# Altium schematic sheet MediaControllerSchem.SchDoc
size A4
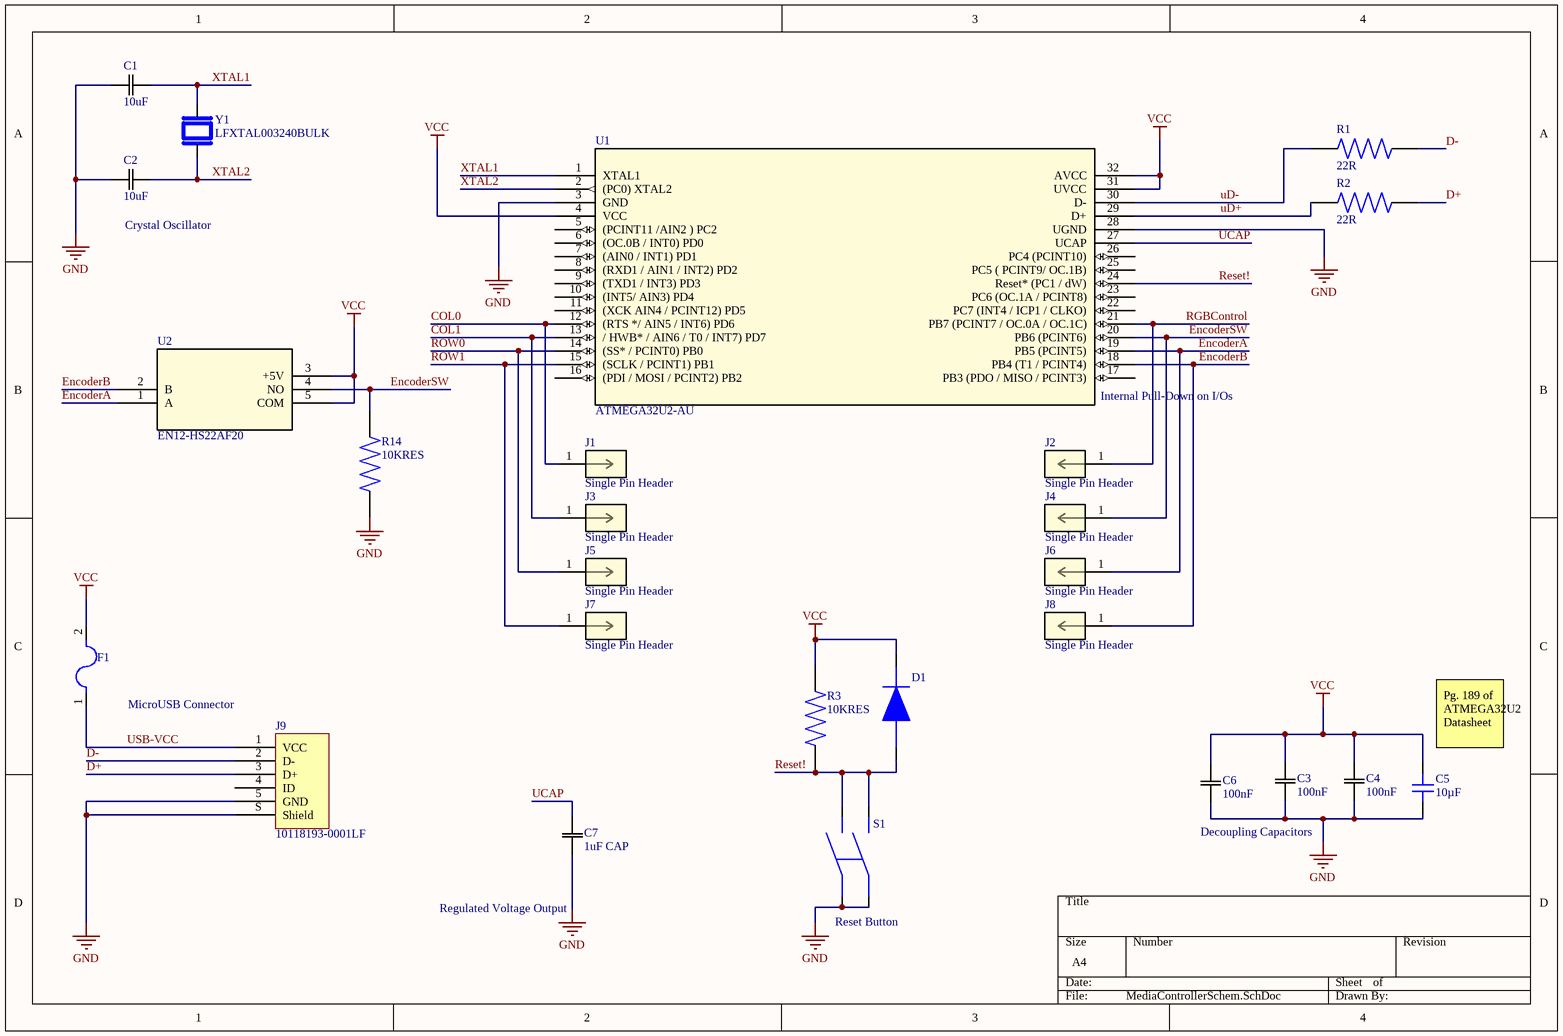
[diagram p0: MediaControllerSchem.SchDoc]

## Parts
C1  10uF  [CAPC17090_87N_KEM-L]
C2  10uF  [CAPC17090_87N_KEM-L]
C3  100nF  [CAPC0603_87N_KEM-M]
C4  100nF  [CAPC0603_87N_KEM-M]
C5  10µF  [CAP 0603_1608]
C6  100nF  [CAPC0603_87N_KEM-M]
C7  1uF CAP  [1UFCAP-M]
D1  RectifierDiode  [DO-219AB_VIS-M]  (value not drawn)
F1  500mAFuse  [FUSC6125X279N]  (value not drawn)
J1  Single Pin Header  [CON1_1X1_TU_TSW]
J2  Single Pin Header  [CON1_1X1_TU_TSW]
J3  Single Pin Header  [CON1_1X1_TU_TSW]
J4  Single Pin Header  [CON1_1X1_TU_TSW]
J5  Single Pin Header  [CON1_1X1_TU_TSW]
J6  Single Pin Header  [CON1_1X1_TU_TSW]
J7  Single Pin Header  [CON1_1X1_TU_TSW]
J8  Single Pin Header  [CON1_1X1_TU_TSW]
J9  10118193-0001LF  [FCI USB 10118193-0001LF]
R1  22R  [RES0603_22OHM]
R2  22R  [RES0603_22OHM]
R3  10KRES  [RES0603]
R14  10KRES  [RES0603]
S1  TacticalSwitch  [TACTILESWITCH]  (value not drawn)
U1  ATMEGA32U2-AU  [32A_ATM]
U2  EN12-HS22AF20  [EN12-HS_TTE]
Y1  LFXTAL003240BULK  [LFXTAL003240BULK]

## Nets
GND: C1.1 C2.1 C3.1 C4.1 C5.1 C6.1 C7.1 J9.5(GND) J9.S(Shield) R14.1 S1.1 S1.2 U1.3(GND) U1.28(UGND)
VCC: C3.2 C4.2 C5.2 C6.2 D1.2 F1.2 R3.2 U1.4(VCC) U1.31(UVCC) U1.32(AVCC) U2.3(+5V) U2.5(COM)
COL0: J1.1 U1.12((RTS_*/_AIN5_/_INT6)_PD6)
COL1: J3.1 U1.13(/_HWB*_/_AIN6_/_T0_/_INT7)_PD7)
D+: J9.3(D+) R2.2
D-: J9.2(D-) R1.2
EncoderA: J6.1 U1.19(PB5_(PCINT5)) U2.1(A)
EncoderB: J8.1 U1.18(PB4_(T1_/_PCINT4)) U2.2(B)
EncoderSW: J4.1 R14.2 U1.20(PB6_(PCINT6)) U2.4(NO)
Reset!: D1.1 R3.1 S1.3 S1.4 U1.24(Reset*_(PC1_/_dW))
RGBControl: J2.1 U1.21(PB7_(PCINT7_/_OC.0A_/_OC.1C))
ROW0: J5.1 U1.14((SS*_/_PCINT0)_PB0)
ROW1: J7.1 U1.15((SCLK_/_PCINT1)_PB1)
UCAP: C7.2 U1.27(UCAP)
uD+: R2.1 U1.29(D+)
uD-: R1.1 U1.30(D-)
USB-VCC: F1.1 J9.1(VCC)
XTAL1: C1.2 U1.1(XTAL1) Y1.2
XTAL2: C2.2 U1.2((PC0)_XTAL2) Y1.1

Not connected (* = marked no-connect by the designer): J9 4(ID); U1 5((PCINT11_/AIN2_)_PC2) 6((OC.0B_/_INT0)_PD0) 7((AIN0_/_INT1)_PD1) 8((RXD1_/_AIN1_/_INT2)_PD2) 9((TXD1_/_INT3)_PD3) 10((INT5/_AIN3)_PD4) 11((XCK_AIN4_/_PCINT12)_PD5) 16((PDI_/_MOSI_/_PCINT2)_PB2) 17(PB3_(PDO_/_MISO_/_PCINT3)) 22(PC7_(INT4_/_ICP1_/_CLKO)) 23(PC6_(OC.1A_/_PCINT8)) 25(PC5_(_PCINT9/_OC.1B)) 26(PC4_(PCINT10))

## Notes on the sheet
- (near C2) Crystal Oscillator
- (near U1) Internal Pull-Down on I/Os
- MicroUSB Connector
- (near C5) Pg. 189 of ATMEGA32U2 Datasheet
- Decoupling Capacitors
- Regulated Voltage Output
- (near S1) Reset Button

## Library data of the parts
C1 C2 = 10pFCap: Multilayer Ceramic Capacitors MLCC - SMD/SMT 50V 10pF C0G 0603 5%; Manufacturer_Part_Number: CBR06C100J5GAC; Vendor: Kemet; SourceLibrary: Kemet_2020-03-25_3; Built_By: EMA_Frank; Source_Library: Kemet_2020-03-25_3.xlr; Type: DEV; Copyright: Copyright (C) 2021 Accelerated Designs. All rights reserved; RefDes: RefDes
C3 C4 C6 = C0603C103J5JACTU: CAP CER 10000PF 50V U2J 0603; Manufacturer: KEMET; Capacitance: 10nF; Tolerance: 5%; Supplier 1: Digi-Key; Supplier Part Number 1: 399-13384-1-ND; Manufacturer Part Number: C0603C103J5JACTU; RoHS: Yes; Category: Ceramic Capacitors; Stock 1: 2465; Pricing 1: 1=0.30000, 10=0.20400, 50=0.13560, 100=0.11530, 500=0.08142, 1000=0.07124 (USD); Mount: Surface Mount; Case/Package: 0603; Case Code (Metric): 1608; Case Code (Imperial): 0603; Min Operating Temperature: -55°C; Max Operating Temperature: 125°C; Packaging: Cut Tape; Voltage Rating: 50V; Dielectric: U2J; Length: 0.063inch; Width: 0.032inch; Thickness: 0.034inch; REACH SVHC: No SVHC; RoHS Compliant: Yes; ComponentLink1URL: http://www.farnell.com/datasheets/2600114.pdf?src-supplier=Farnell; ComponentLink1Description: http://www.farnell.com/datasheets/2600114.pdf?src-supplier=Farnell; ComponentLink2URL: http://www.farnell.com/datasheets/2157975.pdf?src-supplier=Element14; ComponentLink2Description: http://www.farnell.com/datasheets/2157975.pdf?src-supplier=Element14; ComponentLink3URL: https://api.kemet.com/component-edge/download/datasheet/C0603C103J5JAC7867.pdf?src-supplier=Digi-Key; ComponentLink3Description: https://api.kemet.com/component-edge/download/datasheet/C0603C103J5JAC7867.pdf?src-supplier=Digi-Key; ComponentLink4URL: http://www.kemet.com/docfinder?Partnumber=C0603C103J5JAC7867&src-supplier=Digi-Key; ComponentLink4Description: http://www.kemet.com/docfinder?Partnumber=C0603C103J5JAC7867&src-supplier=Digi-Key
C5 = GRM188R61E106MA73D: CAP CER 10UF 25V X5R 0603; Manufacturer: Murata Electronics; Tolerance: ±20%; Part Number: GRM188R61E106MA73D; Value: 10µF; Applications: General Purpose; Capacitance: 10µF; ComponentLink1Description: Datasheet; ComponentLink1URL: https://www.murata.com/~/media/webrenewal/support/library/catalog/products/capacitor/mlcc/c02e.ashx?la=en-us; ComponentLink2Description: DigiKey Link; ComponentLink2URL: http://digikey.com/product-detail/en/murata-electronics/GRM188R61E106MA73D/490-7202-1-ND/3900486; Device Package: 0603 (1608 Metric); LastUpdated: 2/09/2020 1:03:25 AM; Lifecycle Status: Active; Minimum Order: 1; Mounting Type: Surface Mount, MLCC; Operating Temperature: -55°C ~ 85°C; Package / Case: 0603 (1608 Metric); Packaging: TapeAndReel; PartId: 8314; Part Status: Active; Price: 0.09; Series: GRM; Size / Dimension: 0.063" L x 0.031" W (1.60mm x 0.80mm); Supplier 1: DigiKey; Supplier Part Number 1: 490-7202-1-ND; Temperature Coefficient: X5R; Thickness (Max): 0.031" (0.80mm); Voltage - Rated: 25V
C7 = 1uFCap: KEMET - C0603C105K8PACTU - SMD Multilayer Ceramic Capacitor, 1 µF, 10 V, 0603 [1608 Metric], ± 10%, X5R, C Series KEMET; Voltage: 10V; Supplier 1: Digi-Key; Supplier Part Number 1: 399-3118-1-ND; Manufacturer: KEMET; Manufacturer Part Number: C0603C105K8PACTU; RoHS: Yes; Category: Ceramic Capacitors; Stock 1: 16016; Pricing 1: 1=0.10000, 10=0.05600, 50=0.03040, 100=0.02480, 500=0.01772, 1000=0.01392 (USD); Mount: Surface Mount; Case/Package: 0603; Number of Pins: 2; Dielectric Material: Ceramic; Case Code (Imperial): 0603; Case Code (Metric): 1608; Weight: 7.1E-05oz; Min Operating Temperature: -55°C; Max Operating Temperature: 85°C; Tolerance: 10%; Capacitance: 1uF; Packaging: Tape and Reel; Dielectric: X5R; Termination: SMD/SMT; Voltage Rating (DC): 10V; Package Quantity: 1; Voltage Rating: 10V; Series: C; Construction: Flat; Length: 1.6mm; Width: 0.031inch; Height: 0.8mm; Depth: 0.8mm; Thickness: 0.035inch; Radiation Hardening: No; Lead Free: Lead Free; REACH SVHC: No SVHC; RoHS Compliant: Yes; ComponentLink1URL: https://datasheet.ciiva.com/11787/0900766b8116eb59-11787747.pdf?src-supplier=RSComponents; ComponentLink1Description: https://datasheet.ciiva.com/11787/0900766b8116eb59-11787747.pdf?src-supplier=RSComponents; ComponentLink2URL: https://datasheet.ciiva.com/6074/40889-6074647.pdf?src-supplier=Farnell; ComponentLink2Description: https://datasheet.ciiva.com/6074/40889-6074647.pdf?src-supplier=Farnell; ComponentLink3URL: https://datasheet.ciiva.com/26847/getdatasheetpartid-385480-26847548.pdf?src-supplier=Verical; ComponentLink3Description: https://datasheet.ciiva.com/26847/getdatasheetpartid-385480-26847548.pdf?src-supplier=Verical; ComponentLink4URL: https://datasheet.ciiva.com/7823/40889-7823998.pdf?src-supplier=Element14; ComponentLink4Description: https://datasheet.ciiva.com/7823/40889-7823998.pdf?src-supplier=Element14; ComponentLink5URL: https://datasheet.ciiva.com/7823/1929483-7823999.pdf?src-supplier=Element14; ComponentLink5Description: https://datasheet.ciiva.com/7823/1929483-7823999.pdf?src-supplier=Element14; ComponentLink6URL: https://datasheet.ciiva.com/28645/1831760-28645655.pdf?src-supplier=Element14; ComponentLink6Description: https://datasheet.ciiva.com/28645/1831760-28645655.pdf?src-supplier=Element14
D1 = ES07D-GS08: VISHAY - ES07D-GS08 - Fast / Ultrafast Diode, 200 V, 1.2 A, Single, 980 mV, 25 ns, 30 A; Supplier 1: Digi-Key; Supplier Part Number 1: ES07D-GS08CT-ND; Manufacturer: Vishay; Manufacturer Part Number: ES07D-GS08; RoHS: Yes; Category: Rectifier Diodes; Stock 1: 4306; Pricing 1: 1=0.45000, 10=0.36200, 100=0.24640, 500=0.18480, 1000=0.13860 (USD); RoHS Compliant: Yes; ComponentLink1URL: http://www.farnell.com/datasheets/2046053.pdf?src-supplier=Farnell; ComponentLink1Description: http://www.farnell.com/datasheets/2046053.pdf?src-supplier=Farnell
F1 = Fuse: Fuse Chip Fast Acting 0.5A 350V Solder Pad SMD 2410 Ceramic T/R; Manufacturer: Bel; Manufacturer Part Number: 0679H0500-05; Fuse Type: Board Mount (Cartridge Style Excluded); Current Rating: 500mA; Voltage Rating (DC): 72V; DC Cold Resistance: 240mR; Approvals: cURus; Supplier 1: Digi-Key; Supplier Part Number 1: 507-2043-2-ND; RoHS: Yes; Category: Fuses; Stock 1: 5000; Pricing 1: 5000=0.14057, 10000=0.13120 (USD); Mount: Surface Mount; Case/Package: 2410; Case Code (Imperial): 2410; Case Code (Metric): 6125; Min Operating Temperature: -55°C; Max Operating Temperature: 125°C; Packaging: Tape and Reel; Voltage Rating (AC): 350V; RoHS Compliant: Yes; ComponentLink1URL: https://www.mouser.com/ds/2/643/0679H_Jan_2017-1131342.pdf?src-supplier=Mouser; ComponentLink1Description: https://www.mouser.com/ds/2/643/0679H_Jan_2017-1131342.pdf?src-supplier=Mouser; ComponentLink2URL: https://www.belfuse.com/resources/CircuitProtection/datasheets/0679H%20Jan%202017.pdf?src-supplier=Digi-Key; ComponentLink2Description: https://www.belfuse.com/resources/CircuitProtection/datasheets/0679H%20Jan%202017.pdf?src-supplier=Digi-Key
J1-J8 = TSW-101-07-F-S: Samtec TSW, 1 Way, 1 Row, Straight PCB Header; Number of Contacts: 1; Gender: Male; Supplier 1: Digi-Key; Supplier Part Number 1: SAM10323-ND; Manufacturer: Samtec; Manufacturer Part Number: TSW-101-07-F-S; RoHS: Yes; Category: Connectors; Stock 1: 6946; Pricing 1: 1=0.16000, 10=0.15200, 100=0.10500, 500=0.08888, 1000=0.07272, 5000=0.06464, 10000=0.05858 (USD); Mount: Through Hole; Contact Plating: Gold; Contact Material: Bronze; Contact Shape: Square; Contact Finish - Mating: GOLD; Insulation Material: PBT; Insulation Color: Black; Min Operating Temperature: -55°C; Max Operating Temperature: 125°C; Number of Rows: 1; Termination: Solder; Packaging: Bulk; Connector Type: Header; Fastening Type: Pull; Series: TSW; Contact Type: Male Pin; Number of Positions: 1; Radiation Hardening: No; RoHS Compliant: Yes; REACH SVHC: No SVHC; Flammability Rating: UL94 V-0; ComponentLink1URL: https://datasheet.ciiva.com/10337/htsw-th-10337052.pdf?src-supplier=Avnet; ComponentLink1Description: https://datasheet.ciiva.com/10337/htsw-th-10337052.pdf?src-supplier=Avnet
J9 = 10118193-0001LF: CONN RCPT USB2.0 MICRO B SMD R/A; Manufacturer: Amphenol ICC (FCI); Connector Type: USB - micro B; Current Rating (Amps): 1.8A per Contact; Gender: Receptacle; Mating Cycles: 10000; Number of Contacts: 5; Number of Ports: 1; Shielding: Shielded; Voltage - Rated: 100VAC; Part Number: 10118193-0001LF; ComponentLink1Description: Datasheet; ComponentLink1URL: https://cdn.amphenol-icc.com/media/wysiwyg/files/documentation/datasheet/inputoutput/io_usb_micro.pdf; ComponentLink2Description: DigiKey Link; ComponentLink2URL: //digikey.com/product-detail/en/amphenol-icc-fci/10118193-0001LF/609-4616-2-ND/2785388; Features: Solder Retention; LastUpdated: 9/12/2019 8:51:28 PM; Lifecycle Status: 0; Minimum Order: 1; Mounting Feature: Horizontal; Mounting Type: Surface Mount, Right Angle; Through Hole; Operating Temperature: -30°C ~ 80°C; Packaging: TapeAndReel; Part Status: Active; Price: 0.21; Series: -; Specifications: USB 2.0; Supplier 1: DigiKey; Supplier Part Number 1: 609-4616-2-ND; Termination: Solder
R1 R2 = 22Res: RES SMD 22 OHM 5% 1/4W 0603; Manufacturer: Vishay Dale; Manufacturer Part Number: RCS060322R0JNEA; Max Power Dissipation: 250mW; Temperature Coefficient: 200ppm/°C; Supplier 1: Digi-Key; Supplier Part Number 1: 541-2809-1-ND; RoHS: Yes; Category: Chip SMD Resistors; Stock 1: 8840; Pricing 1: 1=0.15000, 10=0.13500, 100=0.05180, 1000=0.02277, 2500=0.01966 (USD); Case/Package: 0603; Case Code (Metric): 1608; Case Code (Imperial): 0603; Min Operating Temperature: -55°C; Max Operating Temperature: 155°C; Packaging: Tape and Reel; Resistance: 22R; Resistor Type: Thick Film; Number of Terminations: 2; Tolerance: 5%; Features: Automotive AEC-Q200; Length: 0.061inch; Width: 0.033inch; Height: 0.02inch; ComponentLink1URL: http://www.vishay.com/docs/20065/rcse3.pdf?src-supplier=Digi-Key; ComponentLink1Description: http://www.vishay.com/docs/20065/rcse3.pdf?src-supplier=Digi-Key
R3 R14 = 10kRes: Res Thick Film 0603 10K Ohm 5% 1/10W ±200ppm/°C Molded SMD; Manufacturer: Vishay Dale; Manufacturer Part Number: RCG060310K0JNEA; Voltage Rating: 75V; Resistance: 10kR; Power Rating: 100mW; Supplier 1: Digi-Key; Supplier Part Number 1: 541-1804-1-ND; RoHS: Yes; Category: Resistors; Stock 1: 1090; Pricing 1: 1=0.10000, 10=0.08700, 100=0.03340, 1000=0.01467, 2500=0.01267 (USD); Case/Package: 0603; Weight: 7.1E-05oz; Case Code (Metric): 1608; Case Code (Imperial): 0603; Min Operating Temperature: -55°C; Max Operating Temperature: 155°C; Packaging: Tape and Reel; Package Quantity: 1; Tolerance: 5%; Resistor Type: Thick Film; Number of Terminations: 2; Max Power Dissipation: 100mW; Temperature Coefficient: 200ppm/°C; Length: 0.061inch; Width: 0.033inch; Height: 0.02inch; RoHS Compliant: Yes; ComponentLink1URL: https://datasheet.ciiva.com/18596/rcge3-18596768.pdf?src-supplier=Digi-Key; ComponentLink1Description: https://datasheet.ciiva.com/18596/rcge3-18596768.pdf?src-supplier=Digi-Key
S1 = TacticalSwitch: E-SWITCH - TL3305AF160QG - TACTILE SW, SPST, 0.05A, 12VDC, SOLDER; Mechanical Life: 500000Cycles; Illumination Type: Non-Illuminated; Operating Force: 160gf; Switch Travel: 0.2mm; Switch Function: Off-Mom; Actuator Type: Standard; Supplier 1: Digi-Key; Supplier Part Number 1: EG5350CT-ND; Manufacturer: E-Switch; Manufacturer Part Number: TL3305AF160QG; RoHS: Yes; Category: Tactile Switches; Stock 1: 60105; Pricing 1: 1=0.18000, 10=0.17900, 25=0.16960, 100=0.15400, 250=0.14480, 500=0.13246, 1000=0.11090 (USD); Mount: Surface Mount; Min Operating Temperature: -20°C; Max Operating Temperature: 70°C; Packaging: Tape and Reel; Termination: Gull Wing; Throw Configuration: SPST; Lead Free: Lead Free; RoHS Compliant: Yes; ComponentLink1URL: http://www.farnell.com/datasheets/2554191.pdf?src-supplier=Farnell; ComponentLink1Description: http://www.farnell.com/datasheets/2554191.pdf?src-supplier=Farnell; ComponentLink2URL: http://spec_sheets.e-switch.com/specs/P010468.pdf?src-supplier=Digi-Key; ComponentLink2Description: http://spec_sheets.e-switch.com/specs/P010468.pdf?src-supplier=Digi-Key; ComponentLink3URL: http://www.farnell.com/datasheets/2554191.pdf?src-supplier=Newark; ComponentLink3Description: http://www.farnell.com/datasheets/2554191.pdf?src-supplier=Newark
U1 = ATMEGA32U2-AU: 8-bit Microcontroller with 8/16/32K Bytes of ISP Flash and USB Controller; Built_By: EMA_UL_Team; Vendor: Atmel; SourceLibrary: Atmel_2011-04-02; Manufacturer_Part_Number: ATMEGA32U2-AU; Copyright: Copyright (C) 2021 Accelerated Designs. All rights reserved; RefDes: RefDes; Type: DEV
U2 = EN12-HS22AF20: BI TECHNOLOGIES / TT ELECTRONICS         EN12-HS22AF20             INCREMENTAL ENCODER; Manufacturer: TT BI; Number of Channels: 2; Operating Supply Voltage: 5V; Encoder Type: Mechanical; Pulses per Revolution: 24; Detent: Yes; Output Type: Quadrature,Incremental; Actuator Type: Shaft; Supplier 1: Digi-Key; Supplier Part Number 1: 987-1195-ND; Manufacturer Part Number: EN12-HS22AF20; RoHS: Yes; Category: Uncategorized; Stock 1: 1275; Pricing 1: 1=1.31000, 5=1.23800, 10=1.15900, 25=1.06400, 40=0.99375, 80=0.89688, 230=0.84839, 440=0.79991, 945=0.75144 (USD); Mount: Through Hole,PCB; Min Operating Temperature: -30°C; Max Operating Temperature: 85°C; Package Quantity: 300; Packaging: Bulk; Nominal Supply Voltage (DC): 5V; Termination: PC Pin; Orientation: Vertical; Built in Switch: Yes; Series: EN12; REACH SVHC: No SVHC; Lead Free: Lead Free; RoHS Compliant: Yes; ComponentLink1URL: https://datasheet.ciiva.com/30179/en12-30179331.pdf?src-supplier=Onlinecomponents.com; ComponentLink1Description: https://datasheet.ciiva.com/30179/en12-30179331.pdf?src-supplier=Onlinecomponents.com; ComponentLink2URL: https://datasheet.ciiva.com/1311/219240-1311686.pdf?src-supplier=Element14; ComponentLink2Description: https://datasheet.ciiva.com/1311/219240-1311686.pdf?src-supplier=Element14
Y1 = LFXTAL003240BULK: 16MHz Â±30ppm Crystal 30pF 40 Ohms HC-49/US; MF: IQD Frequency Products; MP: LFXTAL003240BULK; Price: None; SnapEDA_Link: https://www.snapeda.com/parts/LFXTAL003240BULK/IQD%20Frequency%20Products/view-part/2463585/?ref=snap; Availability: Unavailable; Value: *; Package: HC-49/US IQD Frequency Products; Supplier 1: Digi-Key; Supplier Part Number 1: 1923-1433-ND